# EAGLE design AFM Sprinkler Control (EAGLE 7.5.0)
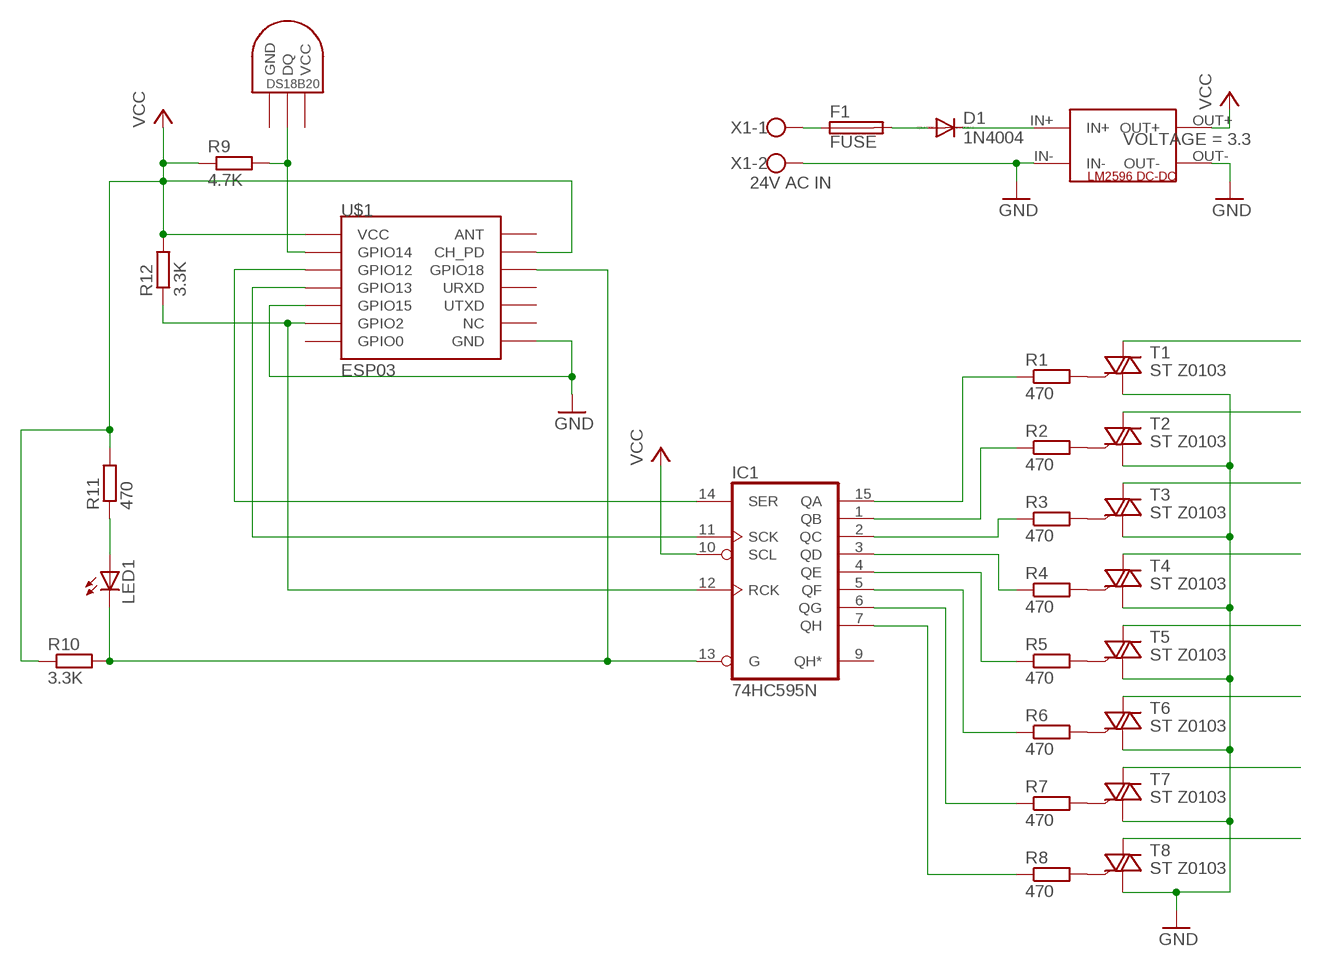
[diagram p0: schematic, sheet 1]

## Parts
D1  1N4004  [DO41-10]
F1  FUSE  19560  [19560]
IC1  74HC595N  [DIL16]
LED1  LED3MM  [LED3MM]
R1  470  R-EU_0204/5  [0204/5]
R2  470  R-EU_0204/5  [0204/5]
R3  470  R-EU_0204/5  [0204/5]
R4  470  R-EU_0204/5  [0204/5]
R5  470  R-EU_0204/5  [0204/5]
R6  470  R-EU_0204/5  [0204/5]
R7  470  R-EU_0204/5  [0204/5]
R8  470  R-EU_0204/5  [0204/5]
R9  4.7K  R-EU_0204/2V  [0204V]
R10  3.3K  R-EU_0204/7  [0204/7]
R11  470  R-EU_0207/10  [0207/10]
R12  3.3K  R-EU_0204/5  [0204/5]
T1  ST Z0103  TIC206AFM  [TO92-AFM]
T2  ST Z0103  TIC206AFM  [TO92-AFM]
T3  ST Z0103  TIC206AFM  [TO92-AFM]
T4  ST Z0103  TIC206AFM  [TO92-AFM]
T5  ST Z0103  TIC206AFM  [TO92-AFM]
T6  ST Z0103  TIC206AFM  [TO92-AFM]
T7  ST Z0103  TIC206AFM  [TO92-AFM]
T8  ST Z0103  TIC206AFM  [TO92-AFM]
U$1  ESP03  [ESP03-BREAKOUT]
U$2  LM2596MOD-ADJ  [LM2596MOD-ADJ]
U$3  DS1820TO92  [DS1820]
X1  24V AC IN  W237-102  [W237-102]

## Nets
24VAC: F1.1 X1.1
GND: T1.T1(A1) T2.T1(A1) T3.T1(A1) T4.T1(A1) T5.T1(A1) T6.T1(A1) T7.T1(A1) T8.T1(A1) U$1.GND U$1.GPIO15 U$2.IN- U$2.OUT- X1.2
N$1: R1.2 T1.G
N$2: R2.2 T2.G
N$3: IC1.2(QC) R3.1
N$4: LED1.A R11.1
N$5: D1.A F1.2
N$6: D1.C U$2.IN+
N$7: R3.2 T3.G
N$8: R4.2 T4.G
N$9: R5.2 T5.G
N$10: R6.2 T6.G
N$11: R7.2 T7.G
N$12: R8.2 T8.G
N$13: IC1.1(QB) R2.1
N$14: T1.T2(A2)
N$15: T2.T2(A2)
N$16: T3.T2(A2)
N$17: T4.T2(A2)
N$18: T5.T2(A2)
N$19: T6.T2(A2)
N$20: T7.T2(A2)
N$21: T8.T2(A2)
N$22: IC1.15(QA) R1.1
N$23: IC1.3(QD) R4.1
N$24: IC1.4(QE) R5.1
N$25: IC1.5(QF) R6.1
N$26: IC1.6(QG) R7.1
N$27: IC1.7(QH) R8.1
N$28: IC1.14(SER) U$1.GPIO12
N$29: IC1.11(SCK) U$1.GPIO13
N$30: IC1.12(RCK) R12.1 U$1.GPIO2
N$31: R9.2 U$1.GPIO14 U$3.DQ
N$33: IC1.13(G) LED1.K(C) R10.2 U$1.GPIO18
VCC: IC1.10(SCL) R9.1 R10.1 R11.2 R12.2 U$1.CH_PD U$1.VCC U$2.OUT+
Unconnected: IC1.9(QH*) U$1.ANT U$1.GPIO0 U$1.NC U$1.URXD U$1.UTXD

## Power pins joined to a net without a drawn wire
GND: IC1.8(GND) U$3.GND
VCC: IC1.16(VCC) U$3.VDD(VCC)

## Library data of the parts
D1 = diode:1N4004: DIODE general purpose rectifier, 1 A
F1 = fuse:19560: FUSE HOLDER TR5, Wickmann; MPN: 56000001009; OC_FARNELL: 1185363; OC_NEWARK: 15P8392
IC1 = 74xx-eu:74*595: 8-bit SHIFT REGISTER, output latch
LED1 = led:LED: LED OSRAM: - CHIPLED LG R971, LG N971, LY N971, LG Q971, LY Q971, LO R971, LY R971 LH N974, LH R974 LS Q976, LO Q976, LY Q976 LO Q996 - Hyper CHIPLED LW Q18S LB Q993, LB Q99A, LB R99A - SideLED LS A670, LO A670, LY A670, LG A670, LP A670 LB A673, LV A673, LT A673, LW A673 LH A674 LY A675 LS A676, LA A676, LO A676, LY A676, LW A676 LS A679, LY A679, LG A679 - Hyper Micro SIDELED® LS Y876, LA Y876, LO Y876, LY Y876 LT Y87S - SmartLED LW L88C, LW L88S LB L89C, LB L89S, LG L890 LS L89K, LO L89K, LY L89K LS L896, LA L896, LO L896, LY L896 - TOPLED LS T670, LO T670, LY T670, LG T670, LP T670 LSG T670, LSP T670, LSY T670, LOP T670, LYG T670 LG T671, LOG T671, LSG T671 LB T673, LV T673, LT T673, LW T673 LH T674 LS T676, LA T676, LO T676, LY T676, LB T676, LH T676, LSB T676, LW T676 LB T67C, LV T67C, LT T67C, LS T67K, LO T67K, LY T67K, LW E67C LS E67B, LA E67B, LO E67B, LY E67B, LB E67C, LV E67C, LT E67C LW T67C LS T679, LY T679, LG T679 LS T770, LO T770, LY T770, LG T770, LP T770 LB T773, LV T773, LT T773, LW T773 LH T774 LS E675, LA E675, LY E675, LS T675 LS T776, LA T776, LO T776, LY T776, LB T776 LHGB T686 LT T68C, LB T68C - Hyper Mini TOPLED® LB M676 - Mini TOPLED Santana® LG M470 LS M47K, LO M47K, LY M47K Source: http://www.osram.convergy.de LUXEON: - LUMILED® LXK2-PW12-R00, LXK2-PW12-S00, LXK2-PW14-U00, LXK2-PW14-V00 LXK2-PM12-R00, LXK2-PM12-S00, LXK2-PM14-U00 LXK2-PE12-Q00, LXK2-PE12-R00, LXK2-PE12-S00, LXK2-PE14-T00, LXK2-PE14-U00 LXK2-PB12-K00, LXK2-PB12-L00, LXK2-PB12-M00, LXK2-PB14-N00, LXK2-PB14-P00, LXK2-PB14-Q00 LXK2-PR12-L00, LXK2-PR12-M00, LXK2-PR14-Q00, LXK2-PR14-R00 LXK2-PD12-Q00, LXK2-PD12-R00, LXK2-PD12-S00 LXK2-PH12-R00, LXK2-PH12-S00 LXK2-PL12-P00, LXK2-PL12-Q00, LXK2-PL12-R00 Source: www.luxeon.com KINGBRIGHT: KA-3528ASYC Source: www.kingbright.com
R1-R12 = resistor:R-EU_: RESISTOR, European symbol
T1-T8 = triac:TIC206: TRIAC Source: http://www.bourns.com/pdfs/tic206.pdf
U$1 = esp8266modules:ESP03: ESP8266 Wifi module 03
U$2 = _AFM:LM2596MOD-ADJ; VOLTAGE: 3.3
U$3 = Ava:DS1820: DS18B20 Programmable Resolution 1-Wire Digital Thermometer Description The DS18B20 digital thermometer provides 9-bit to 12-bit Celsius temperature measurements and has an alarm function with nonvolatile user-programmable upper and lower trigger points. The DS18B20 communicates over a 1-Wire® bus that by definition requires only one data line (and ground) for communication with a central microprocessor. It has an operating temperature range of -55°C to +125°C and is accurate to ±0.5°C over the range of -10°C to +85°C. In addition, the DS18B20 can derive power directly from the data line ("parasite power"), eliminating the need for an external power supply. Each DS18B20 has a unique 64-bit serial code, which allows multiple DS18B20s to function on the same 1-Wire bus. Thus, it is simple to use one microprocessor to control many DS18B20s distributed over a large area. Applications that can benefit from this feature include HVAC environmental controls, temperature monitoring systems inside buildings, equipment, or machinery, and process monitoring and control systems.
X1 = con-wago-500:W237-102: WAGO SCREW CLAMP; MPN: 237-102; OC_FARNELL: unknown; OC_NEWARK: 70K9898

## Board
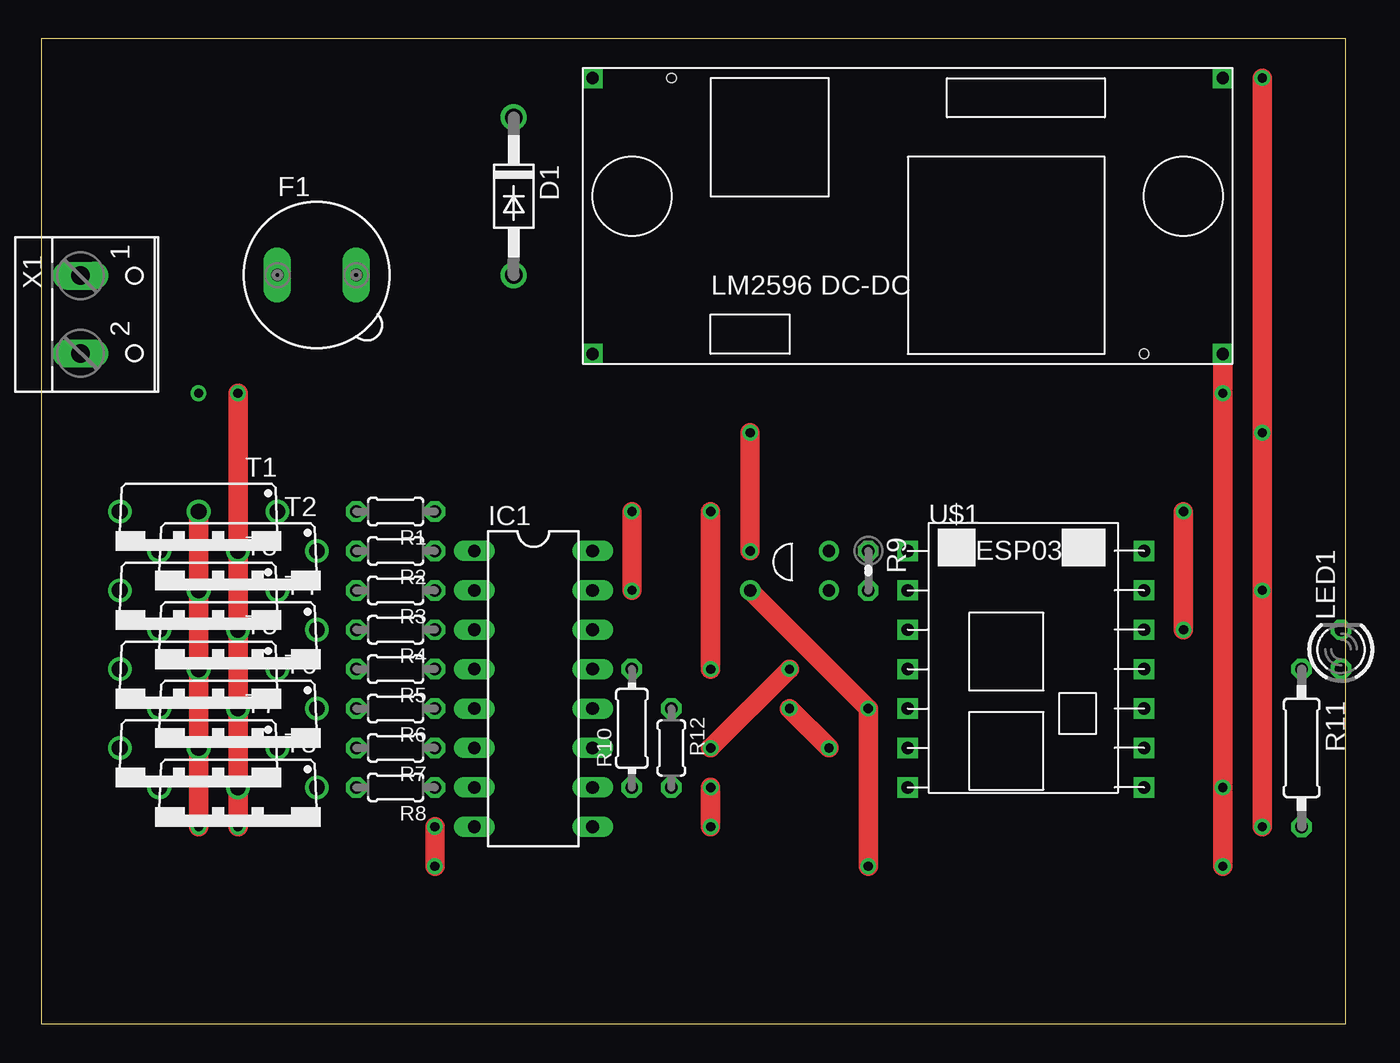
[diagram p1: board, top side]
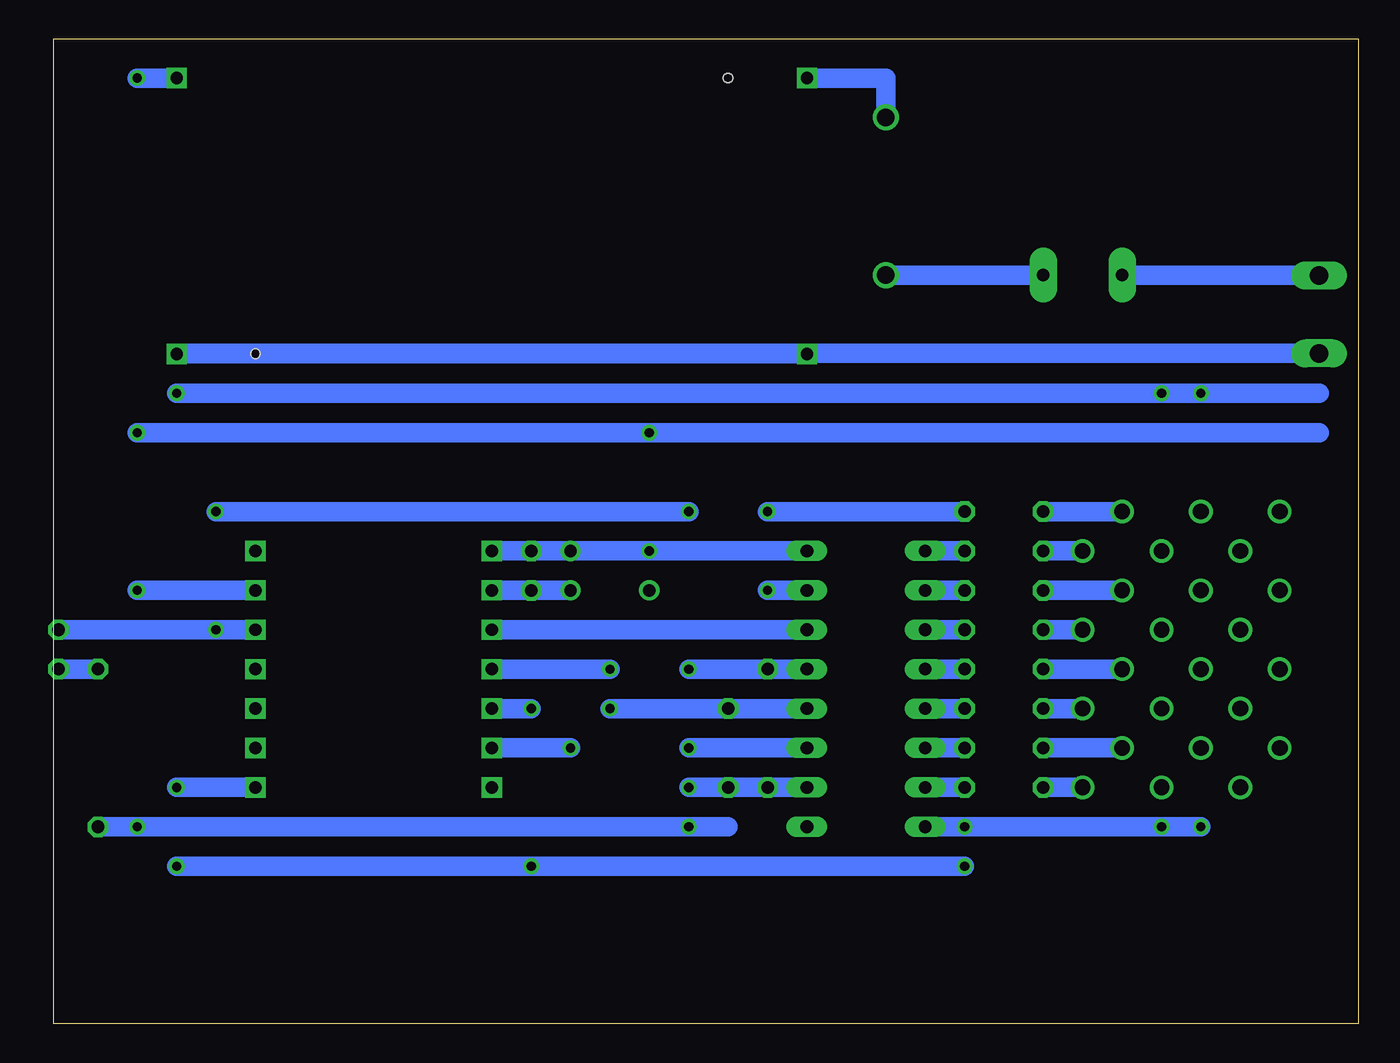
[diagram p2: board, bottom side, seen from below]

Size 84.12 x 63.49 mm. Coordinates in mm from the lower left corner, seen from the top.
Outline: 0,0 84.12,0 84.12,63.49 0,63.49 0,0
Copper layers (1*16): Top 0.035mm / dielectric 1.5mm / Bottom 0.035mm
Design rules "default *": minimum track width 25mil, minimum drill 24mil, track to track 8mil, track to pad 8mil, pad to pad 8mil, via to via 8mil, smd to smd 8mil, copper to edge 40mil, drill to drill 8mil, minimum pad ring 10mil, minimum via ring 8mil, stop-mask expansion 4mil, vias tented up to drill 0mil, thermal gap 10mil

### Footprints (pad centres in the part's own frame; a part is rotated, then mirrored left to right if it is on the bottom)
DO41-10 = drill 1.118: A 5.08,0; C -5.08,0
19560 = drill 0.813 pad 1.778 long: 1 -2.54,0; 2 2.54,0
DIL16 = drill 0.813 long: 1 -8.89,-3.81; 2 -6.35,-3.81; 3 -3.81,-3.81; 4 -1.27,-3.81; 5 1.27,-3.81; 6 3.81,-3.81; 7 6.35,-3.81; 8 8.89,-3.81; 9 8.89,3.81; 10 6.35,3.81; 11 3.81,3.81; 12 1.27,3.81; 13 -1.27,3.81; 14 -3.81,3.81; 15 -6.35,3.81; 16 -8.89,3.81
LED3MM = drill 0.813 octagon: A -1.27,0; K 1.27,0
0204/5 = drill 0.813 octagon: 1 -2.54,0; 2 2.54,0
0204V = drill 0.813 octagon: 1 -1.27,0; 2 1.27,0
0204/7 = drill 0.813 octagon: 1 -3.81,0; 2 3.81,0
0207/10 = drill 0.813 octagon: 1 -5.08,0; 2 5.08,0
TO92-AFM = drill 1.016: G -5.08,-2.54; T1 0,-2.54; T2 5.08,-2.54
ESP03-BREAKOUT = drill 0.8 square: ANT 7.62,7.62; CH_PD 7.62,5.08; GND 7.62,-7.62; GPIO0 -7.62,-7.62; GPIO2 -7.62,-5.08; GPIO12 -7.62,2.54; GPIO13 -7.62,0; GPIO14 -7.62,5.08; GPIO15 -7.62,-2.54; GPIO18 7.62,2.54; NC 7.62,-5.08; URXD 7.62,0; UTXD 7.62,-2.54; VCC -7.62,7.62
LM2596MOD-ADJ = drill 0.8 square: IN+ -25.4,7.62; IN- -25.4,-10.16; OUT+ 15.24,7.62; OUT- 15.24,-10.16 | hole 0.6: 10.16,-10.16; -20.32,7.62
DS1820 = drill 0.8: DQ -1.27,-2.54; GND -1.27,2.54; VDD 1.27,-2.54
W237-102 = drill 1.194 long: 1 -2.5,-1.27; 2 2.5,-1.27

### Placement (x,y rotation side)
D1  30.48,53.34 270 top
F1  17.78,48.26 0 top
IC1  31.75,21.59 270 top
LED1  83.82,24.13 90 top
R1  22.86,33.02 180 top
R2  22.86,30.48 180 top
R3  22.86,27.94 180 top
R4  22.86,25.4 180 top
R5  22.86,22.86 180 top
R6  22.86,20.32 180 top
R7  22.86,17.78 180 top
R8  22.86,15.24 180 top
R9  53.34,29.21 270 top
R10  38.1,19.05 90 top
R11  81.28,17.78 270 top
R12  40.64,17.78 270 top
T1  10.16,30.48 180 top
T2  12.7,27.94 180 top
T3  10.16,25.4 180 top
T4  12.7,22.86 180 top
T5  10.16,20.32 180 top
T6  12.7,17.78 180 top
T7  10.16,15.24 180 top
T8  12.7,12.7 180 top
U$1  63.5,22.86 0 top
U$2  60.96,53.34 0 top
U$3  48.26,29.21 90 top
X1  3.81,45.72 270 top

### Tracks (layer width: path | path; a pad name or v marks a point on that pad's centre or on a via)
24VAC
  Bottom 1.27: F1.1 2.54,48.26 X1.1
GND  (via drill 0.6)
  Top 1.27: T1.T1 T3.T1 T5.T1 T7.T1 v10.16,12.7 | v12.7,12.7 T8.T1 T6.T1 T4.T1 T2.T1 v12.7,40.64 | U$2.OUT- v76.2,40.64 v76.2,15.24 v76.2,10.16 | v25.4,12.7 v25.4,10.16 | v53.34,10.16 v53.34,20.32 U$3.GND
  Bottom 1.27: v10.16,12.7 v12.7,12.7 v25.4,12.7 IC1.8 | X1.2 76.2,43.22 U$2.OUT- U$2.IN- | 2.54,40.64 v10.16,40.64 v12.7,40.64 v76.2,40.64 | v25.4,10.16 v53.34,10.16 v76.2,10.16 | U$1.GND v76.2,15.24 | U$1.GPIO15 v53.34,20.32
  other vias: 76.2,43.18
N$1
  Bottom 1.27: R1.2 T1.G
N$2
  Bottom 1.27: R2.2 T2.G
N$3
  Bottom 1.27: IC1.2 R3.1
N$4
  Bottom 1.27: LED1.A R11.1
N$5
  Bottom 1.27: F1.2 D1.A
N$6
  Bottom 1.27: U$2.IN+ 30.48,60.96 D1.C
N$7
  Bottom 1.27: R3.2 T3.G
N$8
  Bottom 1.27: R4.2 T4.G
N$9
  Bottom 1.27: R5.2 T5.G
N$10
  Bottom 1.27: R6.2 T6.G
N$11
  Bottom 1.27: R7.2 T7.G
N$12
  Bottom 1.27: R8.2 T8.G
N$13
  Bottom 1.27: IC1.1 R2.1
N$22  (via drill 0.6)
  Top 1.27: v38.1,27.94 v38.1,33.02
  Bottom 1.27: IC1.15 v38.1,27.94 | v38.1,33.02 R1.1
N$23
  Bottom 1.27: IC1.3 R4.1
N$24
  Bottom 1.27: IC1.4 R5.1
N$25
  Bottom 1.27: IC1.5 R6.1
N$26
  Bottom 1.27: IC1.6 R7.1
N$27
  Bottom 1.27: IC1.7 R8.1
N$28
  Bottom 1.27: U$1.GPIO12 IC1.14
N$29  (via drill 0.6)
  Top 1.27: v43.18,17.78 v48.26,22.86
  Bottom 1.27: IC1.11 v43.18,17.78 | v48.26,22.86 U$1.GPIO13
N$30  (via drill 0.6)
  Top 1.27: v50.8,17.78 v48.26,20.32
  Bottom 1.27: IC1.12 R12.1 v48.26,20.32 | U$1.GPIO2 v50.8,17.78
N$31
  Bottom 1.27: U$1.GPIO14 R9.2 U$3.DQ
N$33  (via drill 0.6)
  Top 1.27: v73.66,25.4 v73.66,33.02 | v43.18,33.02 v43.18,22.86
  Bottom 1.27: IC1.13 R10.2 v43.18,22.86 | U$1.GPIO18 v73.66,25.4 LED1.K | v73.66,33.02 v43.18,33.02
N$37  (via drill 0.6)
  other vias: 12.7,12.7
N$41  (via drill 0.6)
  other vias: 43.18,15.24
N$42  (via drill 0.6)
  other vias: 78.74,60.96
N$44  (via drill 0.6)
  other vias: 50.8,17.78
N$45  (via drill 0.6)
  other vias: 48.26,20.32
VCC  (via drill 0.6)
  Top 1.27: v78.74,60.96 v78.74,38.1 v78.74,27.94 v78.74,12.7 | v45.72,30.48 v45.72,38.1 | v43.18,15.24 v43.18,12.7
  Bottom 1.27: U$2.OUT+ v78.74,60.96 | U$1.CH_PD v78.74,27.94 | 2.54,38.1 v45.72,38.1 v78.74,38.1 | 40.64,12.7 v43.18,12.7 v78.74,12.7 R11.2 | IC1.10 R10.1 R12.2 v43.18,15.24 | IC1.16 v45.72,30.48 U$3.VDD R9.1 U$1.VCC